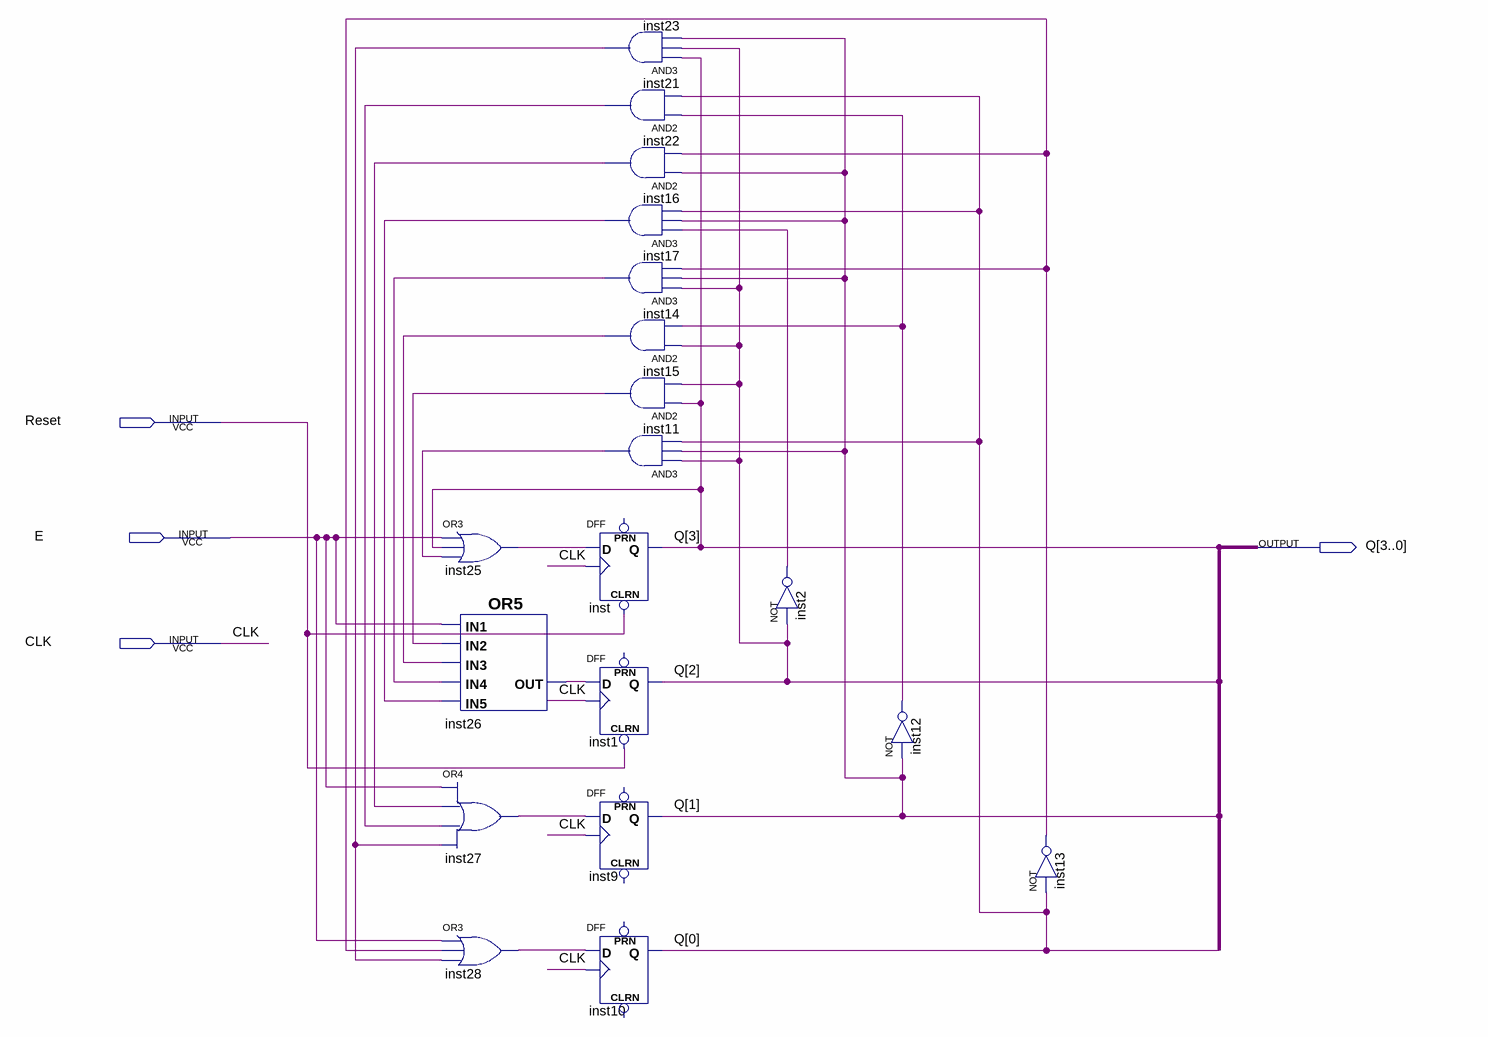
[diagram p0: schematic sheet]
// Quartus schematic back.bdf as structural Verilog: 19 symbols, 4 pins
module back (
  input  Reset,
  input  E,
  input  CLK,
  output [3:0] Q
);

  wire inst2_out, inst11_out, inst12_out, inst13_out, inst14_out, inst15_out, inst16_out, inst17_out,
       inst21_out, inst22_out, inst23_out, inst25_out, inst26_out, inst27_out, inst28_out;

  or inst25 (inst25_out, E, Q[3], inst11_out);
  or inst26 (inst26_out, E, inst15_out, inst14_out, inst17_out, inst16_out);
  or inst27 (inst27_out, E, inst22_out, inst21_out, inst23_out);
  or inst28 (inst28_out, E, inst13_out, inst23_out);
  DFF inst (.CLRN(Reset), .CLK(CLK), .D(inst25_out), .Q(Q[3]));  // open: PRN
  DFF inst1 (.CLRN(Reset), .CLK(CLK), .D(inst26_out), .Q(Q[2]));  // open: PRN
  DFF inst9 (.CLK(CLK), .D(inst27_out), .Q(Q[1]));  // open: CLRN, PRN
  DFF inst10 (.CLK(CLK), .D(inst28_out), .Q(Q[0]));  // open: CLRN, PRN
  and inst23 (inst23_out, Q[3], Q[2], Q[1]);
  and inst21 (inst21_out, inst12_out, Q[0]);
  and inst22 (inst22_out, Q[1], inst13_out);
  and inst16 (inst16_out, inst2_out, Q[1], Q[0]);
  and inst17 (inst17_out, Q[2], Q[1], inst13_out);
  and inst14 (inst14_out, Q[2], inst12_out);
  and inst15 (inst15_out, Q[3], Q[2]);
  and inst11 (inst11_out, Q[2], Q[1], Q[0]);
  not inst2 (inst2_out, Q[2]);
  not inst12 (inst12_out, Q[1]);
  not inst13 (inst13_out, Q[0]);
endmodule
